# Altium schematic sheet ESP32_CN.SchDoc
size A; SheetNumber: 4; SheetTotal: 7
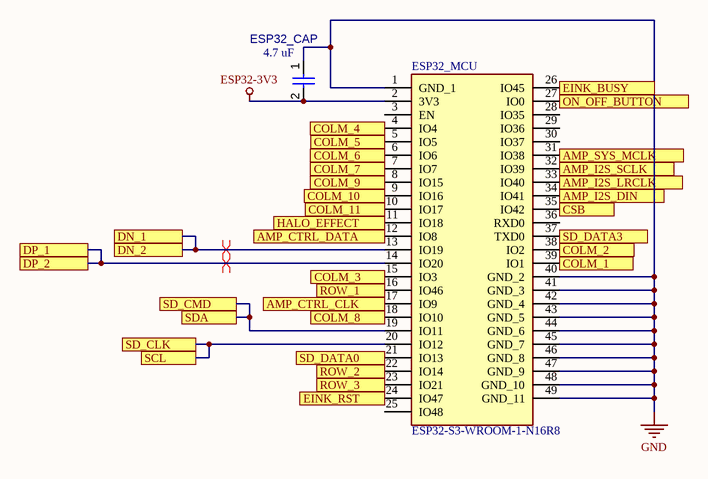
[diagram p0: ESP32_CN.SchDoc]

## Parts
ESP32_CAP  value 4.7 uF  [CAPC0402(1005)60_L]  (hidden comment: Capacitor 10µF +/-40% 6.3V 0402)
ESP32_MCU  ESP32-S3-WROOM-1-N16R8  [ESP32S3WROOM1N16R8]

## Ports
AMP_CTRL_CLK, AMP_CTRL_DATA, AMP_I2S_DIN, AMP_I2S_LRCLK, AMP_I2S_SCLK, AMP_SYS_MCLK, COLM_1, COLM_2, COLM_3, COLM_4, COLM_5, COLM_6, COLM_7, COLM_8, COLM_9, COLM_10, COLM_11, CSB, DN_1, DN_2, DP_1, DP_2, EINK_BUSY, EINK_RST, HALO_EFFECT, ON_OFF_BUTTON, ROW_1, ROW_2, ROW_3, SCL, SD_CLK, SD_CMD, SD_DATA0, SD_DATA3, SDA

## Nets
ESP32-3V3: ESP32_CAP.2 ESP32_MCU.2(3V3)
GND: ESP32_CAP.1 ESP32_MCU.1(GND_1) ESP32_MCU.40(GND_2) ESP32_MCU.41(GND_3) ESP32_MCU.42(GND_4) ESP32_MCU.43(GND_5) ESP32_MCU.44(GND_6) ESP32_MCU.45(GND_7) ESP32_MCU.46(GND_8) ESP32_MCU.47(GND_9) ESP32_MCU.48(GND_10) ESP32_MCU.49(GND_11)
AMP_CTRL_CLK: ESP32_MCU.17(IO9) ; port AMP_CTRL_CLK
AMP_CTRL_DATA: ESP32_MCU.12(IO8) ; port AMP_CTRL_DATA
AMP_I2S_DIN: ESP32_MCU.34(IO41) ; port AMP_I2S_DIN
AMP_I2S_LRCLK: ESP32_MCU.33(IO40) ; port AMP_I2S_LRCLK
AMP_I2S_SCLK: ESP32_MCU.32(IO39) ; port AMP_I2S_SCLK
AMP_SYS_MCLK: ESP32_MCU.31(IO38) ; port AMP_SYS_MCLK
COLM_1: ESP32_MCU.39(IO1) ; port COLM_1
COLM_2: ESP32_MCU.38(IO2) ; port COLM_2
COLM_3: ESP32_MCU.15(IO3) ; port COLM_3
COLM_4: ESP32_MCU.4(IO4) ; port COLM_4
COLM_5: ESP32_MCU.5(IO5) ; port COLM_5
COLM_6: ESP32_MCU.6(IO6) ; port COLM_6
COLM_7: ESP32_MCU.7(IO7) ; port COLM_7
COLM_8: ESP32_MCU.18(IO10) ; port COLM_8
COLM_9: ESP32_MCU.8(IO15) ; port COLM_9
COLM_10: ESP32_MCU.9(IO16) ; port COLM_10
COLM_11: ESP32_MCU.10(IO17) ; port COLM_11
CSB: ESP32_MCU.35(IO42) ; port CSB
DN_1: ESP32_MCU.13(IO19) ; port DN_1, port DN_2
DP_1: ESP32_MCU.14(IO20) ; port DP_1, port DP_2
EINK_BUSY: ESP32_MCU.26(IO45) ; port EINK_BUSY
EINK_RST: ESP32_MCU.24(IO47) ; port EINK_RST
HALO_EFFECT: ESP32_MCU.11(IO18) ; port HALO_EFFECT
ON_OFF_BUTTON: ESP32_MCU.27(IO0) ; port ON_OFF_BUTTON
ROW_1: ESP32_MCU.16(IO46) ; port ROW_1
ROW_2: ESP32_MCU.22(IO14) ; port ROW_2
ROW_3: ESP32_MCU.23(IO21) ; port ROW_3
SCL: ESP32_MCU.20(IO12) ; port SD_CLK, port SCL
SD_CMD: ESP32_MCU.19(IO11) ; port SD_CMD, port SDA
SD_DATA0: ESP32_MCU.21(IO13) ; port SD_DATA0
SD_DATA3: ESP32_MCU.37(TXD0) ; port SD_DATA3

Not connected (* = marked no-connect by the designer): ESP32_MCU 3(EN) 25(IO48) 28(IO35) 29(IO36) 30(IO37) 36(RXD0)

## Layout directives
differential pair: DN_1, DP_1

## Library data of the parts
ESP32_CAP = CMP-001-00074-3: Chip Capacitor, 10µF +/-40%, 6.3V, 0402, Thickness 0.6 mm; Tolerance: 10%; Case/Package: 0402; Pins: 2; Mounting Technology: SMT; Voltage Rating: 6.3V; Max Operating Temperature: 85°C; Min Operating Temperature: -55°C
ESP32_MCU = ESP32-S3-WROOM-1-N16R8: Integrated Circuit; Manufacturer_Name: Espressif Systems; Datasheet Link: https://www.espressif.com/sites/default/files/documentation/esp32-s3-wroom-1_wroom-1u_datasheet_en.pdf; Height: 3.25mm; Manufacturer_Part_Number: ESP32-S3-WROOM-1-N16R8; Mouser Part Number: 356-ESP32S3WRM1N16R8; Mouser Price/Stock: https://www.mouser.co.uk/ProductDetail/Espressif-Systems/ESP32-S3-WROOM-1-N16R8?qs=Li%252BoUPsLEnvQc9gW6AMhZg%3D%3D